# Altium project Qaud FC V10.3.PrjPcb
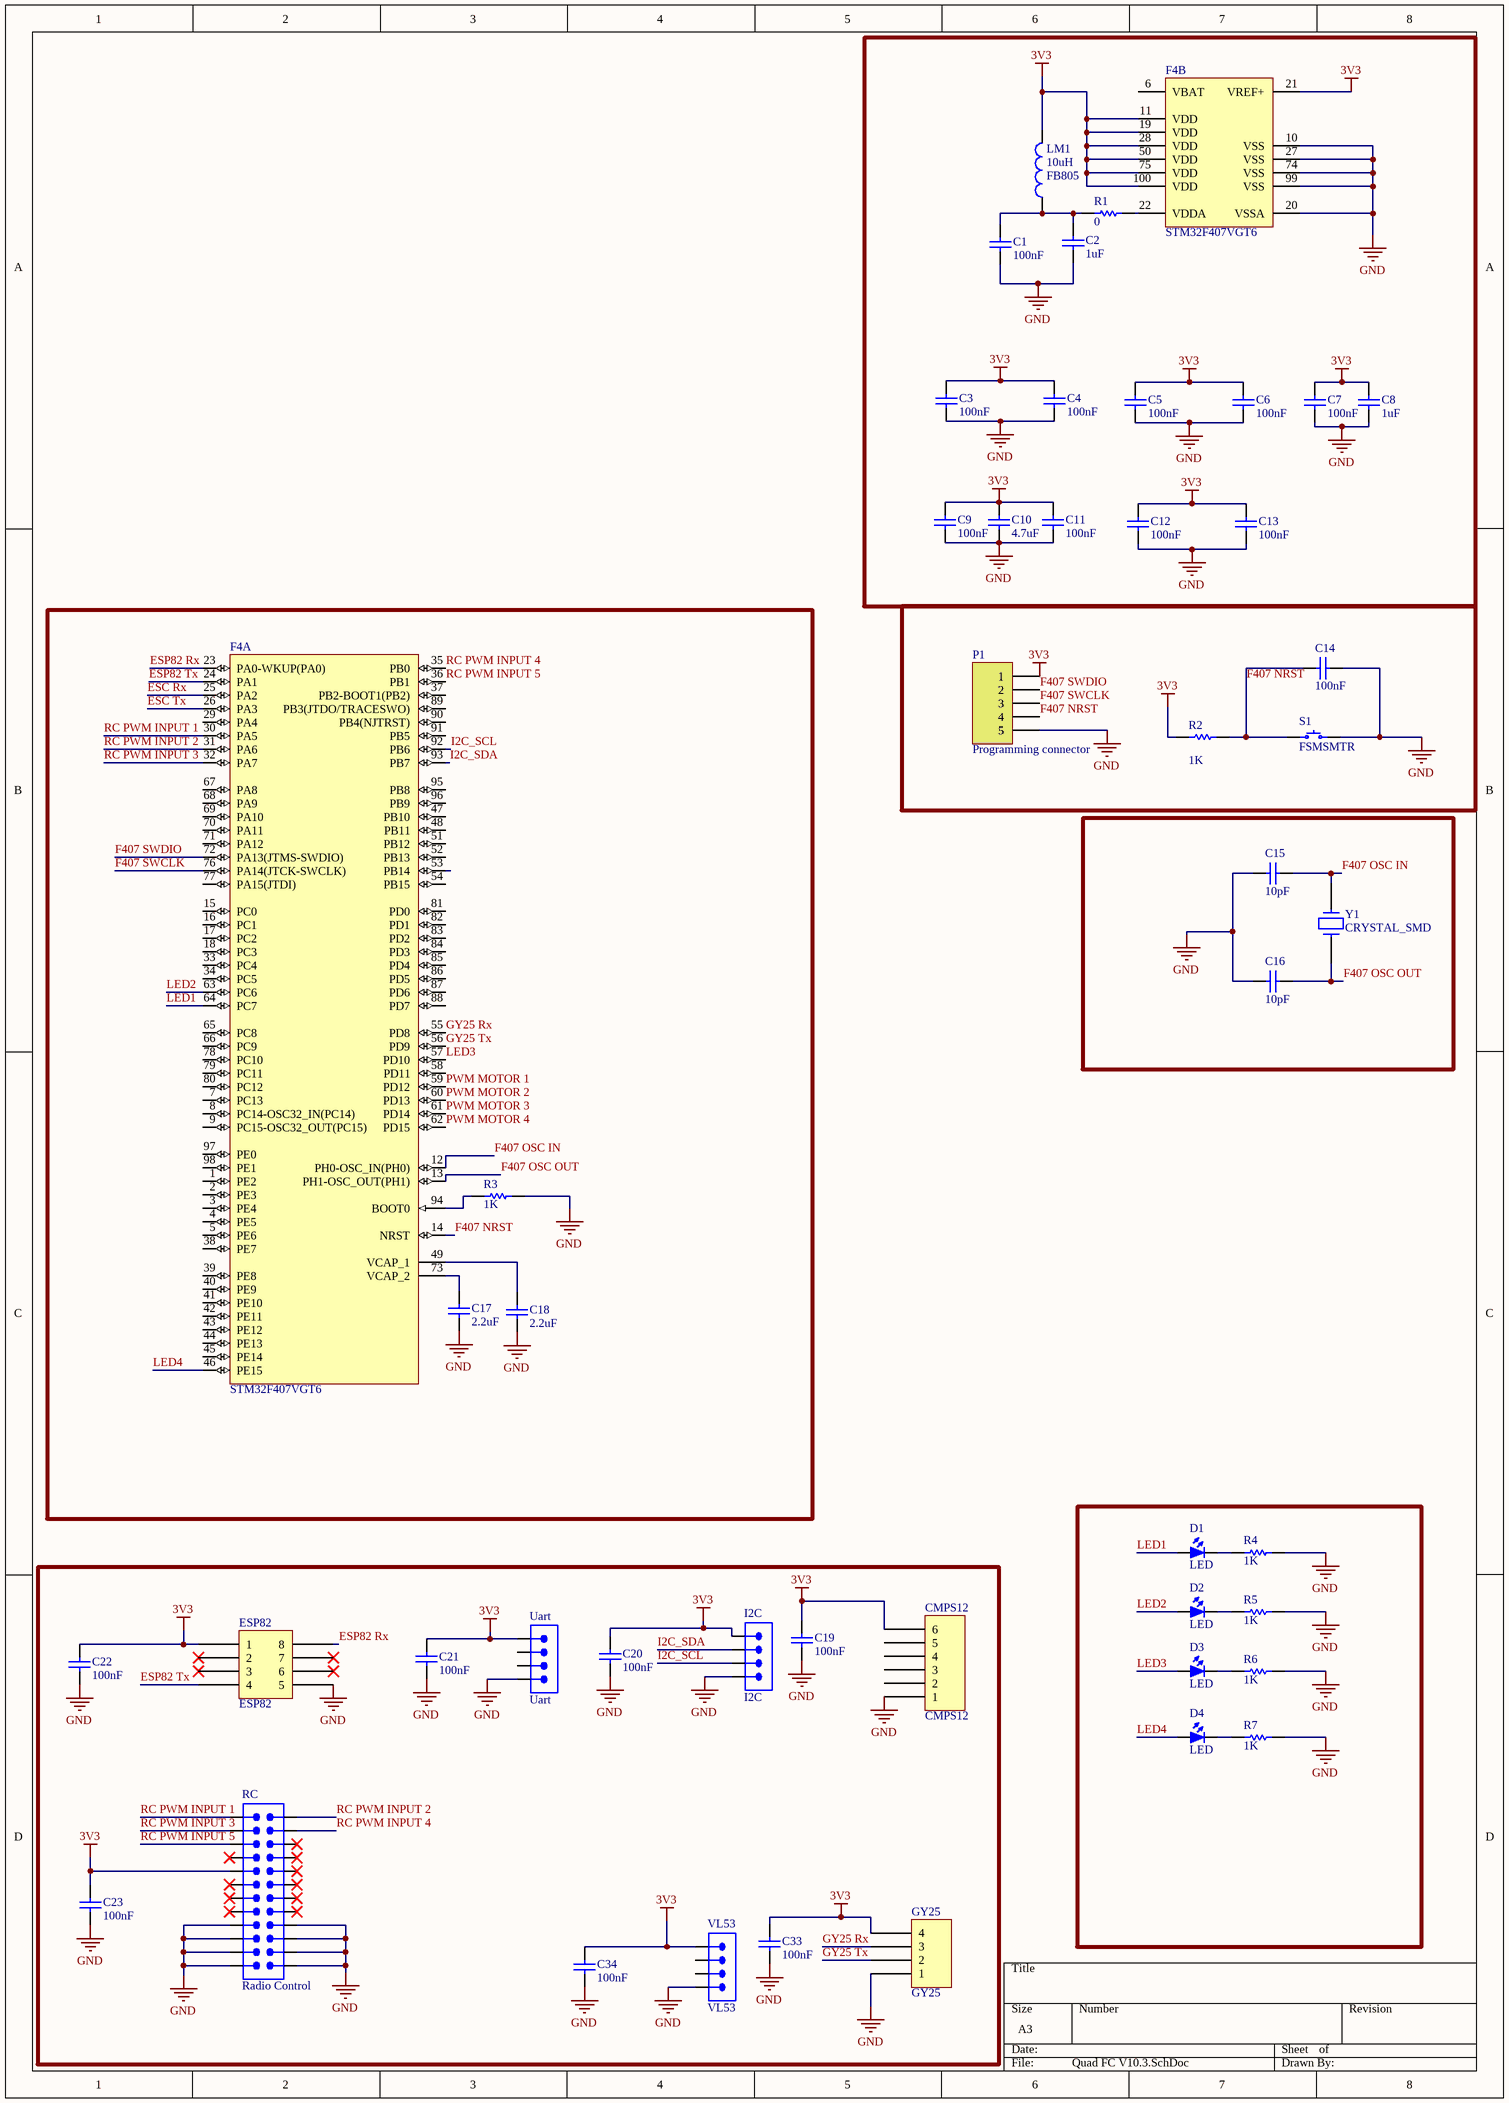
[diagram p0: Quad FC V10.3.SchDoc]
1 sheet, 48 parts. Net scope: global (net labels, ports and power ports of the same name join across sheets).
Board files: Quad FC V10.3.PcbDoc, PCB1.PcbDoc

## Sheet Quad FC V10.3.SchDoc
size A3 portrait; SheetNumber: 1; SheetTotal: 2

### Parts
C1  100nF  [CAP0603]
C2  1uF  [CAP0603]
C3  100nF  [CAP0603]
C4  100nF  [CAP0603]
C5  100nF  [CAP0603]
C6  100nF  [CAP0603]
C7  100nF  [CAP0603]
C8  1uF  [CAP0603]
C9  100nF  [CAP0603]
C10  4.7uF  [CAP0603]
C11  100nF  [CAP0603]
C12  100nF  [CAP0603]
C13  100nF  [CAP0603]
C14  100nF  [CAP0603]
C15  10pF  [CAP0603]
C16  10pF  [CAP0603]
C17  2.2uF  [CAP0603]
C18  2.2uF  [CAP0603]
C19  100nF  [CAP0603]
C20  100nF  [CAP0603]
C21  100nF  [CAP0603]
C22  100nF  [CAP0603]
C23  100nF  [CAP0603]
C33  100nF  [CAP0603]
C34  100nF  [CAP0603]
CMPS12  CMPS12  [SAMTEC SSW-106-03-T-S]
D1  LED  [0603 - LED]
D2  LED  [0603 - LED]
D3  LED  [0603 - LED]
D4  LED  [0603 - LED]
ESP82  ESP82  [HARWIN M20-7830445]
F4  STM32F407VGT6  [STM-LQFP100_N]  (parts A,B of 2)
GY25  GY25  [SAMTEC SSW-104-03-T-S]
I2C  I2C  [JST BM04B-SURS-TF]
LM1  10uH  value FB805  [0805L]
P1  Programming connector  [Connector1X5]
R1  0  [RES0603]
R2  1K  [RES0603]
R3  1K  [RES0603]
R4  1K  [RES0603]
R5  1K  [RES0603]
R6  1K  [RES0603]
R7  1K  [RES0603]
RC  Radio Control  [HEADER8X3]
S1  FSMSMTR  [TE FSMSMTR]
Uart  Uart  [JST BM04B-SURS-TF]
VL53  VL53  [JST BM04B-SURS-TF]
Y1  CRYSTAL_SMD  [My_Crystal - SMD]

### Nets
3V3: C3.2 C4.2 C5.2 C6.2 C7.1 C8.1 C9.2 C10.2 C11.2 C12.2 C13.2 C19.1 C20.1 C21.1 C22.1 C23.1 C33.1 C34.1 CMPS12.6 ESP82.1 F4.11(VDD) F4.19(VDD) F4.21(VREF+) F4.28(VDD) F4.50(VDD) F4.75(VDD) F4.100(VDD) GY25.4 I2C.1 LM1.2 P1.1 R2.1 RC.9 Uart.1 VL53.1
GND: C1.1 C2.1 C3.1 C4.1 C5.1 C6.1 C7.2 C8.2 C9.1 C10.1 C11.1 C12.1 C13.1 C14.2 C15.1 C16.2 C17.2 C18.2 C19.2 C20.2 C21.2 C22.2 C23.2 C33.2 C34.2 CMPS12.1 ESP82.5 F4.10(VSS) F4.20(VSSA) F4.27(VSS) F4.74(VSS) F4.99(VSS) GY25.1 I2C.4 P1.5 R3.2 R4.2 R5.2 R6.2 R7.2 RC.17 RC.18 RC.19 RC.20 RC.21 RC.22 RC.23 RC.24 S1.2 Uart.4 VL53.4
ESC Rx: F4.25(PA2)
ESC Tx: F4.26(PA3)
ESP82 Rx: ESP82.8 F4.23(PA0-WKUP(PA0))
ESP82 Tx: ESP82.4 F4.24(PA1)
F407 NRST: C14.1 F4.14(NRST) P1.4 R2.2 S1.1
F407 OSC IN: C15.2 F4.12(PH0-OSC_IN(PH0)) Y1.2
F407 OSC OUT: C16.1 F4.13(PH1-OSC_OUT(PH1)) Y1.1
F407 SWCLK: F4.76(PA14(JTCK-SWCLK)) P1.3
F407 SWDIO: F4.72(PA13(JTMS-SWDIO)) P1.2
GY25 Rx: F4.55(PD8) GY25.3
GY25 Tx: F4.56(PD9) GY25.2
I2C_SCL: F4.92(PB6) I2C.3
I2C_SDA: F4.93(PB7) I2C.2
LED1: D1.1(A) F4.64(PC7)
LED2: D2.1(A) F4.63(PC6)
LED3: D3.1(A) F4.57(PD10)
LED4: D4.1(A) F4.46(PE15)
PWM MOTOR 1: F4.59(PD12)
PWM MOTOR 2: F4.60(PD13)
PWM MOTOR 3: F4.61(PD14)
PWM MOTOR 4: F4.62(PD15)
RC PWM INPUT 1: F4.30(PA5) RC.1
RC PWM INPUT 2: F4.31(PA6) RC.2
RC PWM INPUT 3: F4.32(PA7) RC.3
RC PWM INPUT 4: F4.35(PB0) RC.4
RC PWM INPUT 5: F4.36(PB1) RC.5
NetC1_2: C1.2 C2.2 LM1.1 R1.1
NetC17_1: C17.1 F4.73(VCAP_2)
NetC18_1: C18.1 F4.49(VCAP_1)
NetD1_2: D1.2(K) R4.1
NetD2_2: D2.2(K) R5.1
NetD3_2: D3.2(K) R6.1
NetD4_2: D4.2(K) R7.1
NetF4_22: F4.22(VDDA) R1.2
NetF4_94: F4.94(BOOT0) R3.1

Not connected (* = marked no-connect by the designer): CMPS12 2 3 4 5; ESP82 2* 3* 6* 7*; F4 1(PE2) 2(PE3) 3(PE4) 4(PE5) 5(PE6) 6(VBAT) 7(PC13) 8(PC14-OSC32_IN(PC14)) 9(PC15-OSC32_OUT(PC15)) 15(PC0) 16(PC1) 17(PC2) 18(PC3) 29(PA4) 33(PC4) 34(PC5) 37(PB2-BOOT1(PB2)) 38(PE7) 39(PE8) 40(PE9) 41(PE10) 42(PE11) 43(PE12) 44(PE13) 45(PE14) 47(PB10) 48(PB11) 51(PB12) 52(PB13) 53(PB14) 54(PB15) 58(PD11) 65(PC8) 66(PC9) 67(PA8) 68(PA9) 69(PA10) 70(PA11) 71(PA12) 77(PA15(JTDI)) 78(PC10) 79(PC11) 80(PC12) 81(PD0) 82(PD1) 83(PD2) 84(PD3) 85(PD4) 86(PD5) 87(PD6) 88(PD7) 89(PB3(JTDO/TRACESWO)) 90(PB4(NJTRST)) 91(PB5) 95(PB8) 96(PB9) 97(PE0) 98(PE1); RC 6* 7* 8* 10* 11* 12* 13* 14* 15* 16*; Uart 2 3; VL53 2 3

### Library data of the parts
C1-C23 C33 C34 = CAP SMD PACKAGE: F407VET6 Power CAP; Designer: Abbas Basereh; Desc.: CAP SMD TOTAL PACKAGES; Data: 2017-3-10
CMPS12 = SSW-106-03-T-S: CONN RCPT 6POS 0.1 TIN PCB; Manufacturer: Samtec Inc.; Connector Type: Receptacle; Contact Length - Post: 0.394" (10.00mm); Current Rating (Amps): 5.7A per Contact; Material Flammability Rating: UL94 V-0; Number of Positions: 6; Number of Positions Loaded: All; Pitch - Mating: 0.100" (2.54mm); Style: Board to Board or Cable; Part Number: SSW-106-03-T-S; ComponentLink1Description: Datasheet; ComponentLink1URL: http://suddendocs.samtec.com/prints/ssw-s.pdf; ComponentLink2Description: DigiKey Link; ComponentLink2URL: https://www.digikey.com/en/products/detail/samtec-inc/SSW-106-03-T-S/1790202; Contact Finish - Mating: Tin; Contact Finish - Post: Tin; Contact Type: Forked; Fastening Type: Push-Pull; Insulation Color: Black; Insulation Height: 0.335" (8.51mm); LastUpdated: 6/21/2022 3:09:22 PM; Lifecycle Status: Active; Minimum Order: 1; Mounting Type: Through Hole; Number of Rows: 1; Operating Temperature: -55°C ~ 105°C; Packaging: Bulk; Part Status: Active; Price: 0.55; Series: SSW; Supplier 1: DigiKey; Supplier Part Number 1: SAM8865-ND; Termination: Solder
ESP82 = M20-7830442: CONN RCPT 8POS 0.1 GOLD PCB; Manufacturer: Harwin Inc.; Connector Type: Receptacle; Contact Length - Post: 0.118" (3.00mm); Current Rating (Amps): 3A; Mated Stacking Heights: 11.04mm, 12.63mm; Material Flammability Rating: UL94 V-0; Number of Positions: 8; Number of Positions Loaded: All; Pitch - Mating: 0.100" (2.54mm); Style: Board to Board or Cable; Part Number: M20-7830442; ComponentLink1Description: Datasheet; ComponentLink1URL: https://cdn.harwin.com/pdfs/C001XX_M20_Series_Connectors.pdf; ComponentLink2Description: DigiKey Link; ComponentLink2URL: http://digikey.com/product-detail/en/harwin-inc/M20-7830442/952-1789-ND/3727758; Contact Finish - Mating: Gold; Contact Finish - Post: Tin; Contact Finish Thickness - Mating: Flash; Contact Type: Female Socket; Fastening Type: Push-Pull; Insulation Color: Black; Insulation Height: 0.335" (8.51mm); LastUpdated: 9/21/2022 7:04:26 PM; Lifecycle Status: Active; Minimum Order: 1; Mounting Type: Through Hole; Number of Rows: 2; Operating Temperature: -40°C ~ 105°C; Packaging: Tube; Part Status: Active; Price: 1.36; Row Spacing - Mating: 0.100" (2.54mm); Series: M20; Supplier 1: DigiKey; Supplier Part Number 1: 952-1789-ND; Termination: Solder
F4 = STM32F407VGT6: ARM Cortex-M4 32-bit MCU+FPU, 210 DMIPS, 1024 kB Flash, 192 kB Internal RAM, 82 I/Os, 100-pin LQFP, -40 to 85 degC, Tray; Manufacturer: STMicroelectronics; D/A Converter: 2x12-bit; FLASH Size (Prog) (kB): 1024; I/Os (High Current): 82; Internal RAM Size (kB): 192; Operating Frequency(F) (Processor speed) (MHz): 168; Supply Voltage(Vcc) max (V): 3.6; Supply Voltage(Vcc) min (V): 1.8; DatasheetVersion: Rev. 4; PackageVersion: Rev. 1, 06/2013; PackageReference: LQFP100; PackageDescription: 100-Pin Low Profile Quad Flat Package, 14 x 14 mm Body, 0.5 mm Pitch; Supplier 1: Digi-Key; Supplier Part Number 1: 497-11605-ND; Supplier 2: Farnell; Supplier Part Number 2: 2064368; Supplier 3: Newark; Supplier Part Number 3: 73T2333; Supplier 4: Mouser; Supplier Part Number 4: 511-STM32F407VGT6; Core: ARM Cortex-M4; Packing: Tray; Mounting Technology: Surface Mount; PartNumber: STM32F407VGT6; ComponentLink1Description: Manufacturer URL; ComponentLink1URL: http://www.st.com/web/en/home.html; ComponentLink2Description: Datasheet; ComponentLink2URL: http://www.st.com/st-web-ui/static/active/en/resource/technical/document/datasheet/DM00037051.pdf; ComponentLink3Description: Package Specification; ComponentLink3URL: http://www.st.com/st-web-ui/static/active/en/resource/technical/document/data_brief/DM00071938.pdf
GY25 = SSW-104-03-T-S: CONN RCPT 4POS 0.1 TIN PCB; Manufacturer: Samtec Inc.; Connector Type: Receptacle; Current Rating (Amps): 5.7A per Contact; Material Flammability Rating: UL94 V-0; Number of Positions: 4; Number of Positions Loaded: All; Style: Board to Board or Cable; Part Number: SSW-104-03-T-S; ComponentLink2Description: DigiKey Link; ComponentLink2URL: http://digikey.com/product-detail/en/samtec-inc/SSW-104-03-T-S/SSW-104-03-T-S-ND/7874034; Contact Finish - Mating: Tin; Contact Finish - Post: Tin; Contact Type: Forked; Fastening Type: Push-Pull; Insulation Color: Black; LastUpdated: 6/21/2022 3:08:52 PM; Lifecycle Status: Active; Minimum Order: 1; Mounting Type: Through Hole; Number of Rows: 1; Operating Temperature: -55°C ~ 105°C; Packaging: Bulk; Part Status: Active; Price: 0.83; Series: SSW; Supplier 1: DigiKey; Supplier Part Number 1: SSW-104-03-T-S-ND; Termination: Solder
I2C Uart VL53 = MHDR_1X04: Male Header 1X04
LM1 = L SMA 0.25W: Inductor; Code_IEC: 1005; Published: 8-Jun-2000; LatestRevisionDate: 29-May-2009; LatestRevisionNote: IPC-7351 Footprint Added.; PackageReference: 0402-A; Publisher: Altium Limited; PackageDescription: Chip Inductor; Code_JEITA: 0402
P1 = Connector1x5: Connector, 5-Pin2.5mm; LatestRevisionDate: 17-Jul-2002; LatestRevisionNote: Re-released for DXP Platform.; Publisher: Altium Limited
R1-R7 = RES SMD PACKAGE: TOTAL SMD RESISTOR PACK; Designer: Abbas Basereh; Desc.: RES SMD PAKAGES; Data: 2017-3-10
  R1: VALUE: 0
  R2-R7: VALUE: 1K
RC = MHDR_2X12: Male Header 2X12
S1 = FSMSMTR: SWITCH TACTILE SPST-NO 0.05A 24V; Manufacturer: TE Connectivity ALCOSWITCH Switches; Actuator Height off PCB, Vertical: 4.57mm; Actuator Orientation: Top Actuated; Actuator Type: Standard; Contact Rating @ Voltage: 0.05A @ 24VDC; Illumination: Non-Illuminated; Operating Force: 180gf; Outline: 6.00mm x 3.50mm; Switch Function: Off-Mom; Part Number: FSMSMTR; Circuit: SPST-NO; ComponentLink1Description: Datasheet; ComponentLink1URL: https://www.te.com/commerce/DocumentDelivery/DDEController?Action=srchrtrv&DocNm=1437566-3&DocType=Customer+Drawing&DocLang=English; ComponentLink2Description: DigiKey Link; ComponentLink2URL: https://www.digikey.com/en/products/detail/te-connectivity-alcoswitch-switches/FSMSMTR/529671; LastUpdated: 2/8/2024 9:49:52 PM; Lifecycle Status: Active; Minimum Order: 1; Mounting Type: Surface Mount; Operating Temperature: -35°C ~ 85°C; Packaging: TapeAndReel; Part Status: Active; Price: 0.20; Series: FSMSM; Supplier 1: DigiKey; Supplier Part Number 1: 450-1758-1-ND; Termination Style: Gull Wing
Y1 = CRYSTAL_SMD: Crystal
D1-D4 = LED: Published: 8-Jun-2000; LatestRevisionDate: 08-Jul-2005; LatestRevisionNote: Mech Layer 1 removed.; PackageReference: LED-0; Publisher: Altium Limited